# EAGLE design G-PiC Door Controller (EAGLE 6.2)
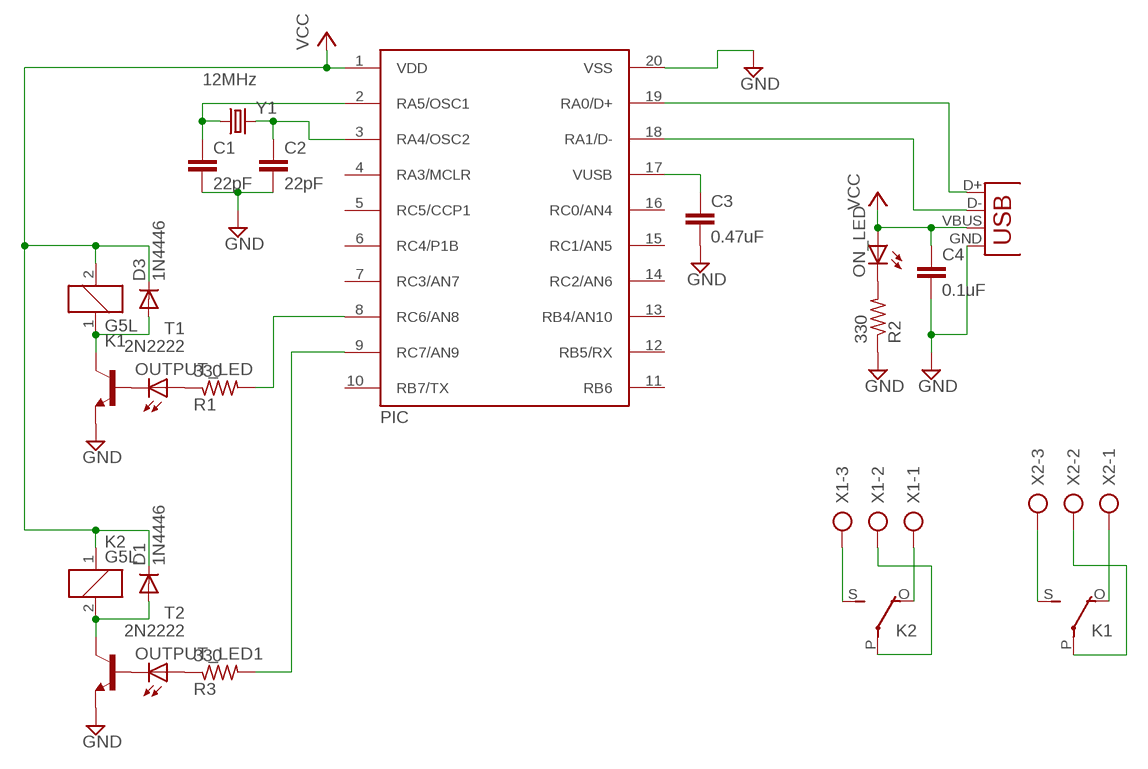
[diagram p0: schematic, sheet 1]

## Parts
C1  22pF  C5/3  [C5B3]
C2  22pF  C5/3  [C5B3]
C3  0.47uF  C5/3  [C5B3]
C4  0.1uF  C2,5-3  [C2.5-3]
D1  1N4446  [DO35-10]
D3  1N4446  [DO35-10]
K1  G5L  [G5LE]
K2  G5L  [G5LE]
ON_LED  LED3MM  [LED3MM]
OUTPUT_LED  LED3MM  [LED3MM]
OUTPUT_LED1  LED3MM  [LED3MM]
PIC  PIC18F14K50  [DIL20]
R1  330  R-US_0204/7  [0204/7]
R2  330  R-US_0204/7  [0204/7]
R3  330  R-US_0204/7  [0204/7]
T1  2N2222  [TO92-EBC-OVAL]
T2  2N2222  [TO92-EBC-OVAL]
X1  AK500/3-H  [AK500/3-H]
X2  AK500/3-H  [AK500/3-H]
X3  USBPTH  [USB-B-PTH]
Y1  12MHz  CRYSTALHC49US  [HC49US]

## Nets
GND: C1.2 C2.2 C3.2 C4.2 PIC.20(VSS) R2.1 T1.E T2.E X3.GND
N$1: D3.A K1.1 T1.C
N$2: OUTPUT_LED.K(C) T1.B
N$3: OUTPUT_LED.A R1.1
N$4: D1.A K2.2 T2.C
N$5: PIC.8(RC6/AN8) R1.2
N$6: ON_LED.K(C) R2.2
N$7: C2.1 PIC.3(RA4/OSC2) Y1.2
N$8: C1.1 PIC.2(RA5/OSC1) Y1.1
N$9: OUTPUT_LED1.A R3.1
N$10: PIC.9(RC7/AN9) R3.2
N$11: C3.1 PIC.17(VUSB)
N$12: K1.O(2:O) X2.1
N$13: K1.S(2:S) X2.3
N$14: K1.P(2:P) X2.2
N$15: PIC.19(RA0/D+) X3.D+
N$16: PIC.18(RA1/D-) X3.D-
N$17: OUTPUT_LED1.K(C) T2.B
N$20: K2.S(2:S) X1.3
N$21: K2.O(2:O) X1.1
N$22: K2.P(2:P) X1.2
VCC: C4.1 D1.C D3.C K1.2 K2.1 ON_LED.A PIC.1(VDD) X3.VBUS
Unconnected: PIC.4(RA3/MCLR) PIC.5(RC5/CCP1) PIC.6(RC4/P1B) PIC.7(RC3/AN7) PIC.10(RB7/TX) PIC.11(RB6) PIC.12(RB5/RX) PIC.13(RB4/AN10) PIC.14(RC2/AN6) PIC.15(RC1/AN5) PIC.16(RC0/AN4)

## Library data of the parts
C1-C4 = capacitor-wima:C: CAPACITOR naming: grid - package width
D1 D3 = diode:1N4446: DIODE high speed (Philips)
K1 K2 = relay:G5L: RELAY 1 x switch, 10 A/120 V AC, 8 A/30 V ADC, Omron; OC_FARNELL: unknown; OC_NEWARK: unknown
ON_LED OUTPUT_LED OUTPUT_LED1 = adafruit:LED: LED OSRAM: - CHIPLED LG R971, LG N971, LY N971, LG Q971, LY Q971, LO R971, LY R971 LH N974, LH R974 LS Q976, LO Q976, LY Q976 LO Q996 - Hyper CHIPLED LW Q18S LB Q993, LB Q99A, LB R99A - SideLED LS A670, LO A670, LY A670, LG A670, LP A670 LB A673, LV A673, LT A673, LW A673 LH A674 LY A675 LS A676, LA A676, LO A676, LY A676, LW A676 LS A679, LY A679, LG A679 - Hyper Micro SIDELED® LS Y876, LA Y876, LO Y876, LY Y876 LT Y87S - SmartLED LW L88C, LW L88S LB L89C, LB L89S, LG L890 LS L89K, LO L89K, LY L89K LS L896, LA L896, LO L896, LY L896 - TOPLED LS T670, LO T670, LY T670, LG T670, LP T670 LSG T670, LSP T670, LSY T670, LOP T670, LYG T670 LG T671, LOG T671, LSG T671 LB T673, LV T673, LT T673, LW T673 LH T674 LS T676, LA T676, LO T676, LY T676, LB T676, LH T676, LSB T676, LW T676 LB T67C, LV T67C, LT T67C, LS T67K, LO T67K, LY T67K, LW E67C LS E67B, LA E67B, LO E67B, LY E67B, LB E67C, LV E67C, LT E67C LW T67C LS T679, LY T679, LG T679 LS T770, LO T770, LY T770, LG T770, LP T770 LB T773, LV T773, LT T773, LW T773 LH T774 LS E675, LA E675, LY E675, LS T675 LS T776, LA T776, LO T776, LY T776, LB T776 LHGB T686 LT T68C, LB T68C - Hyper Mini TOPLED® LB M676 - Mini TOPLED Santana® LG M470 LS M47K, LO M47K, LY M47K Source: http://www.osram.convergy.de/
PIC = pic18f14k50:PIC18F14K50
R1-R3 = adafruit:R-US_: RESISTOR, American symbol
T1 T2 = adafruit:2N2222: NPN TRANSISTOR Big oval pads
X1 X2 = con-ptr500:AK500/3-H: CONNECTOR Aug. 2004 / PTR Meßtechnik: Die Bezeichnung der Serie AK505 wurde geändert. Es handelt sich hierbei um AK500 in horizontaler Ausführung.; OC_FARNELL: unknown; OC_NEWARK: unknown
X3 = SparkFun:USB: USB Connectors USB-B-PTH is fully proven SKU : PRT-00139 USB-miniB is fully proven SKU : PRT-00587 USB-A-PCB is untested. USB-A-H is throughly reviewed, but untested. Spark Fun Electronics SKU : PRT-00437 USB-B-SMT is throughly reviewed, but untested. Needs silkscreen touching up. USB-A-S has not been used/tested USB-MB-H has not been used/tested
Y1 = SparkFun:CRYSTAL: Crystals Various standard crystals. Proven footprints. Spark Fun Electronics SKU : COM-00534

## Board
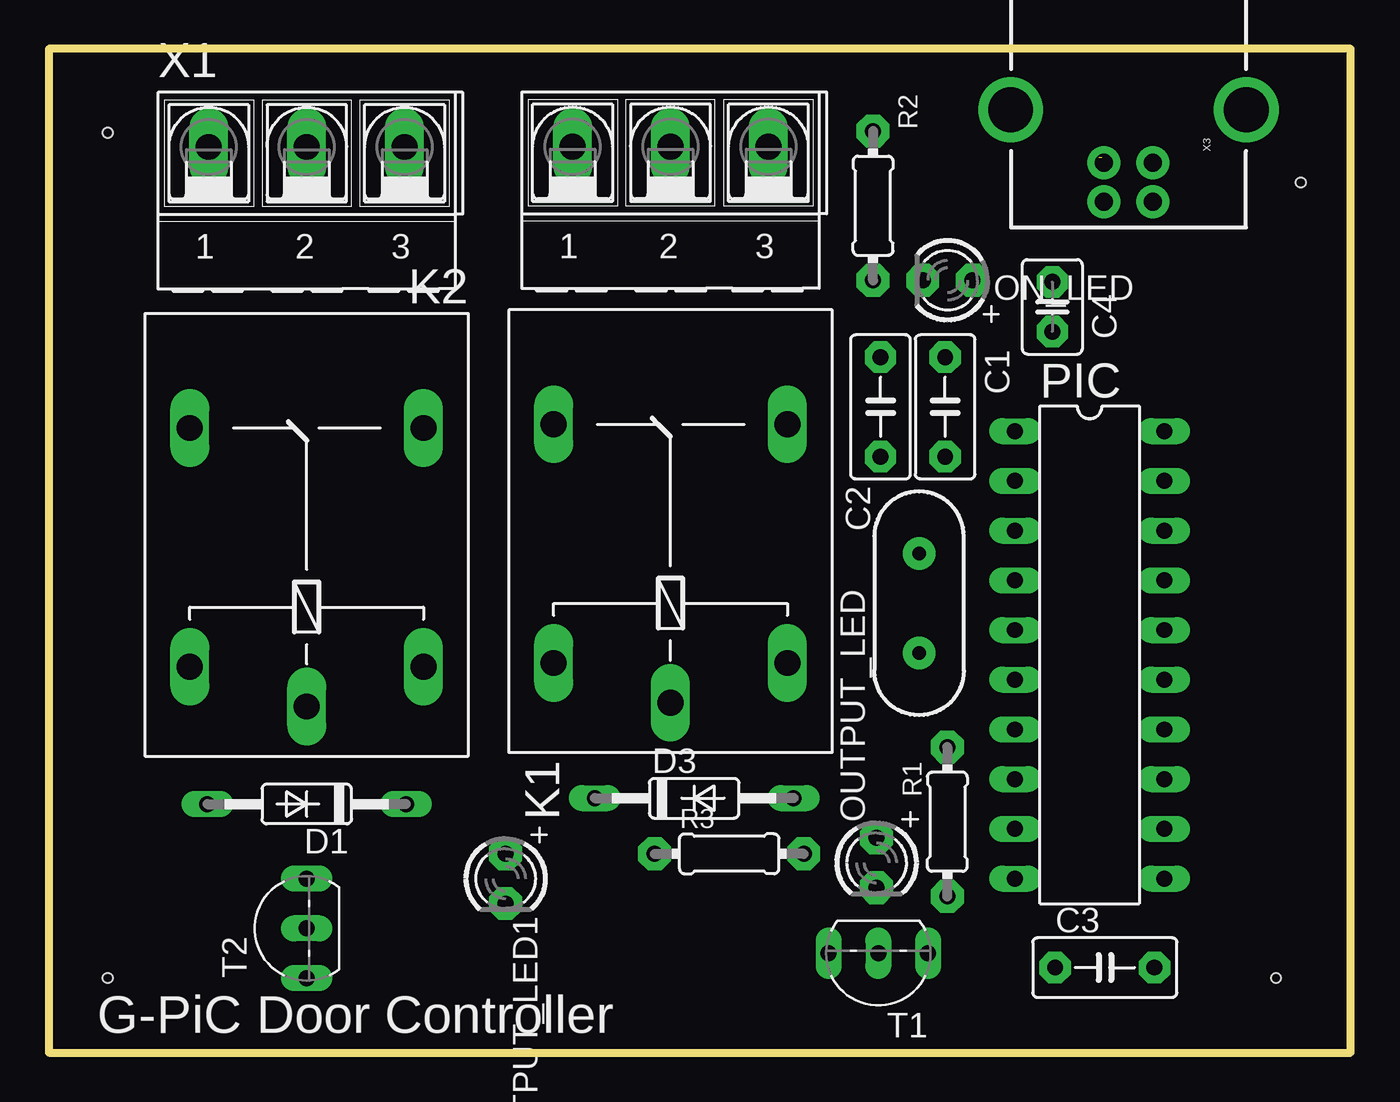
[diagram p1: board, top side]
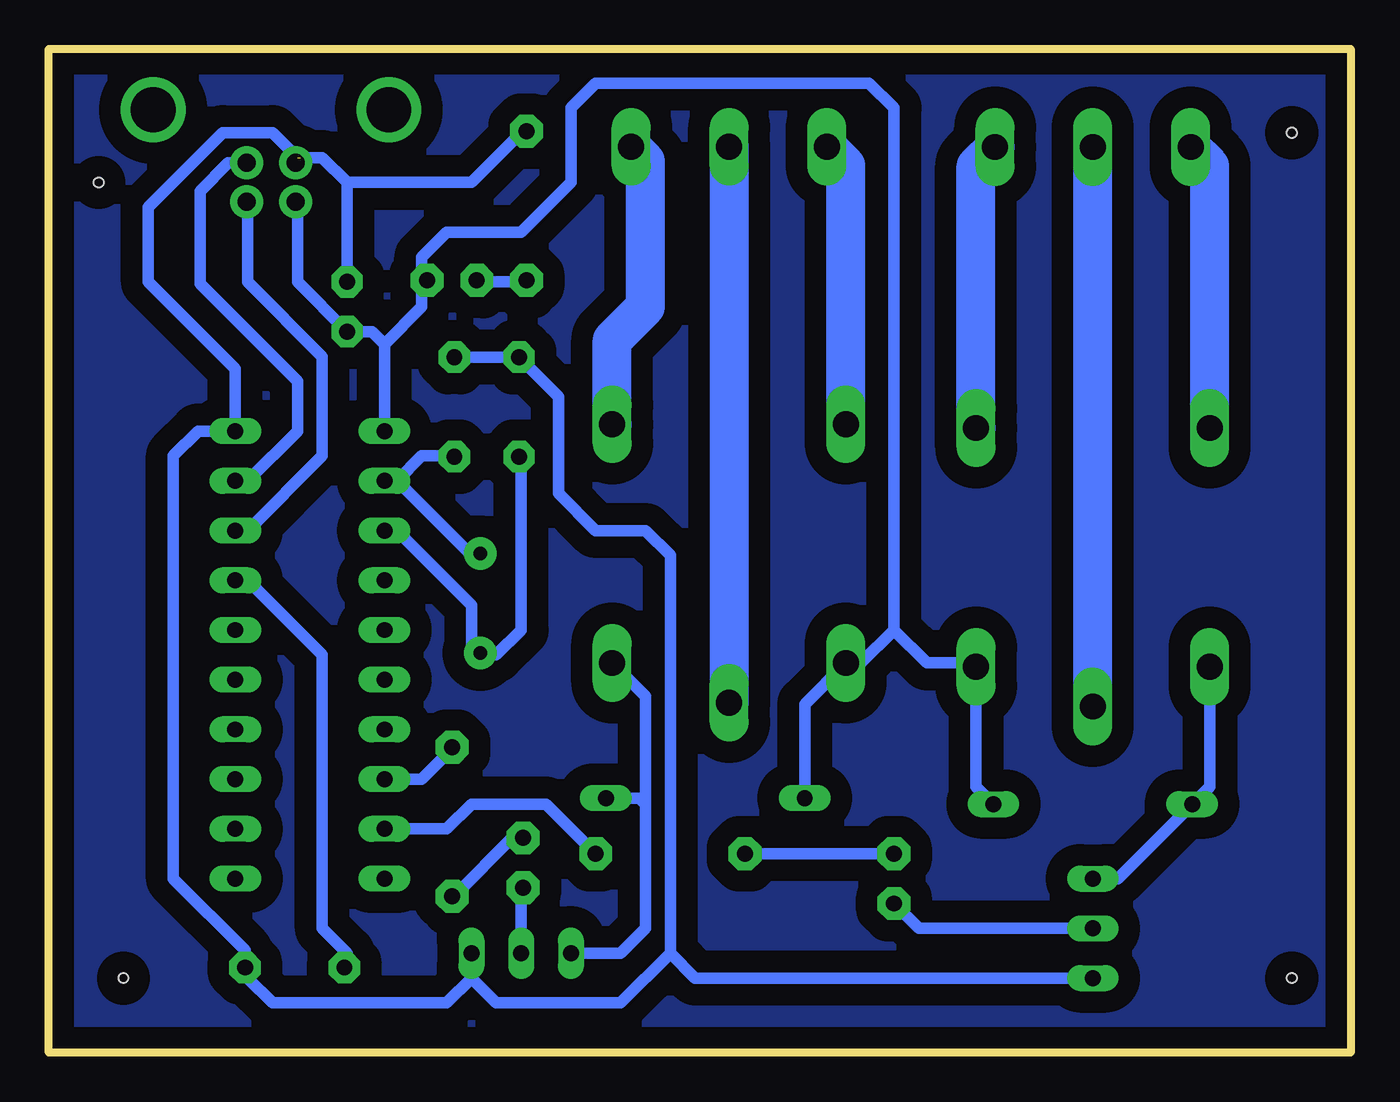
[diagram p2: board, bottom side, seen from below]

Size 66.51 x 51.27 mm. Coordinates in mm from the lower left corner, seen from the top.
Outline: 66.51,0 66.51,51.27 0,51.27 0,0 66.51,0
Copper layers (1*16): Top 0.035mm / dielectric 1.5mm / Bottom 0.035mm
Design rules: minimum track width 0.6mm, minimum drill 0.6mm, track to track 0.6mm, track to pad 0.6mm, pad to pad 0.6mm, via to via 0.7mm, smd to smd 8mil, copper to edge 40mil, drill to drill 8mil, minimum pad ring 10mil, minimum via ring 8mil, stop-mask expansion 4mil, vias tented up to drill 0mil, thermal gap 10mil
Holes 0.5 mm at 3.01,3.81 62.7,3.81 3.01,46.99 63.97,44.45

### Footprints (pad centres in the part's own frame; a part is rotated, then mirrored left to right if it is on the bottom)
C5B3 = drill 0.813 pad 1.6 octagon: 1 -2.54,0; 2 2.54,0
C2.5-3 = drill 0.813 pad 1.6 octagon: 1 -1.27,0; 2 1.27,0
DO35-10 = drill 0.813 long: A 5.08,0; C -5.08,0
G5LE = drill 1.321 long: 1 -7.493,-5.969; 2 -7.493,5.969; O 4.699,5.969; P -9.525,0; S 4.699,-5.969
LED3MM = drill 0.813 pad 1.676 octagon: A -1.27,0; K 1.27,0
DIL20 = drill 0.813 long: 1 -11.43,-3.81; 2 -8.89,-3.81; 3 -6.35,-3.81; 4 -3.81,-3.81; 5 -1.27,-3.81; 6 1.27,-3.81; 7 3.81,-3.81; 8 6.35,-3.81; 9 8.89,-3.81; 10 11.43,-3.81; 11 11.43,3.81; 12 8.89,3.81; 13 6.35,3.81; 14 3.81,3.81; 15 1.27,3.81; 16 -1.27,3.81; 17 -3.81,3.81; 18 -6.35,3.81; 19 -8.89,3.81; 20 -11.43,3.81
0204/7 = drill 0.813 pad 1.676 octagon: 1 -3.81,0; 2 3.81,0
TO92-EBC-OVAL = drill 0.813 long: B 0,-1.27; C 2.54,-1.27; E -2.54,-1.27
AK500/3-H = drill 1.321 long: 1 -5.004,0; 2 0,0; 3 5.004,0
USB-B-PTH = drill 0.914 pad 1.676: D+ 0,1.25; D- 1.981,1.25; GND 0,-1.25; VBUS 1.981,-1.25 | drill 2.286: S1 -2.718,-6.02; S2 -2.718,6.02
HC49US = drill 0.7 pad 1.651: 1 -2.54,0; 2 2.54,0

### Placement (x,y rotation side)
C1  45.79,32.99 90 top
C2  42.49,32.99 90 top
C3  53.95,4.35 0 top
C4  51.27,38.1 90 top
D1  13.17,12.7 180 top
D3  32.97,13 0 top
K1  31.76,27.4 90 top
K2  13.17,27.21 90 top
ON_LED  45.92,39.45 180 top
OUTPUT_LED  42.28,9.7 270 top
OUTPUT_LED1  23.33,8.89 270 top
PIC  53.17,20.32 270 top
R1  45.9,11.8 90 top
R2  42.11,43.26 270 top
R3  34.76,10.16 0 top
T1  42.38,3.81 180 top
T2  11.9,6.35 90 top
X1  13.17,46.26 0 top
X2  31.76,46.27 0 top
X3  55.16,45.45 270 top
Y1  44.46,22.95 270 top

### Tracks (layer width: path | path; a pad name or v marks a point on that pad's centre or on a via)
GND  (1 unrouted)
  Bottom 0.6: R2.1 42.38,46.99 44.92,44.45 51.27,44.45 | 34.76,5.08 34.76,25.4 36.03,26.67 38.57,26.67 40.48,28.57 40.48,33.51 C2.2 C1.2 | T2.E 33.49,3.81 34.76,5.08 | 34.76,5.08 37.3,2.54 43.65,2.54 44.92,3.81 | 53.81,45.72 55.08,46.99 57.62,46.99 61.43,43.18 61.43,39.37 56.98,34.92 PIC.20 58.89,31.75 60.16,30.48 60.16,8.89 56.49,5.22 C3.2 56.35,3.81 55.08,2.54 46.19,2.54 44.92,3.81 | 44.92,3.81 T1.E | C4.2 51.27,44.45 | 51.27,44.45 52.54,45.72 53.64,45.72 X3.GND
GND1
  pour Bottom (isolate 1.1): -0.16,-0.27 -0.16,51.54 66.78,51.54 66.78,-0.27
N$1
  Bottom 0.6: T1.C 37.3,5.08 36.03,6.35 36.03,12.7 | 36.03,12.7 36.03,18.21 K1.1 | D3.A 36.33,13 36.03,12.7
N$2
  Bottom 0.6: T1.B 42.38,8.34 OUTPUT_LED.K
N$3
  Bottom 0.6: R1.1 46.19,7.62 42.38,11.43 OUTPUT_LED.A
N$4
  Bottom 0.6: K2.2 7.2,13.59 D1.A 11.9,8.89 T2.C
N$5
  Bottom 0.6: R1.2 45.9,15.53 47.46,13.97 PIC.8
N$6
  Bottom 0.6: ON_LED.K 44.92,39.37 42.38,39.37 R2.2
N$7
  Bottom 0.6: PIC.3 48.73,26.67 44.92,22.86 44.92,20.32 Y1.2 43.65,20.32 42.38,21.59 42.38,30.48 C2.1
N$8
  Bottom 0.6: 48.73,29.21 47.46,30.48 46.19,30.48 C1.1 | 48.73,29.21 44.92,25.4 Y1.1 | PIC.2 48.73,29.21
N$9
  Bottom 0.6: OUTPUT_LED1.A R3.1
N$10
  Bottom 0.6: R3.2 41.11,12.7 44.92,12.7 46.19,11.43 PIC.9
N$11
  Bottom 0.6: PIC.17 56.35,24.13 52.54,20.32 52.54,6.35 51.27,5.08 C3.1
N$12
  Bottom 2: K1.O 25.79,45.31 X2.1
N$13
  Bottom 2: K1.S 37.73,36.4 36.03,38.1 36.03,45.54 X2.3
N$14
  Bottom 2: X2.2 K1.P
N$15
  Bottom 0.6: PIC.19 56.35,29.21 53.81,31.75 53.81,34.29 58.79,39.27 58.79,44.01 57.35,45.45 X3.D+
N$16
  Bottom 0.6: PIC.18 56.35,26.67 52.54,30.48 52.54,35.56 56.35,39.37 56.35,43.41 X3.D-
N$17
  Bottom 0.6: T2.B 22.06,6.35 OUTPUT_LED1.K
N$20
  Bottom 2: K2.S 19.14,45.3 X1.3
N$21
  Bottom 2: K2.O 7.2,45.3 X1.1
N$22
  Bottom 2: K2.P X1.2
VCC
  Bottom 0.6: 47.46,39.37 47.46,40.64 46.19,41.91 42.38,41.91 39.84,44.45 39.84,48.26 38.57,49.53 24.6,49.53 23.33,48.26 23.33,21.59 | 47.46,39.37 ON_LED.A | D1.C 19.14,13.59 K2.1 19.33,19.91 21.65,19.91 23.33,21.59 | D3.C 27.89,17.81 K1.2 25.01,19.91 23.33,21.59 | PIC.1 49.37,36.2 | X3.VBUS 53.81,43.37 53.81,39.37 C4.1 50,36.83 49.37,36.2 | 47.46,39.37 47.46,38.1 49.37,36.2

### Text on the board
tNames: G-PiC Door Controller
Labels: NC | COM | NO | NC | COM | NO | 330 | USB PORT | 22pF | 22pF | RELE2 | RELE1 | 12MHz | PIC18F14K50 | LED2 | 330 | 330 | LED1 | BC547 | BC547 | 0.47 uF